# EAGLE schematic Solar-Powered Smart Plant Monitoring IoT Device (EAGLE 9.6.2)
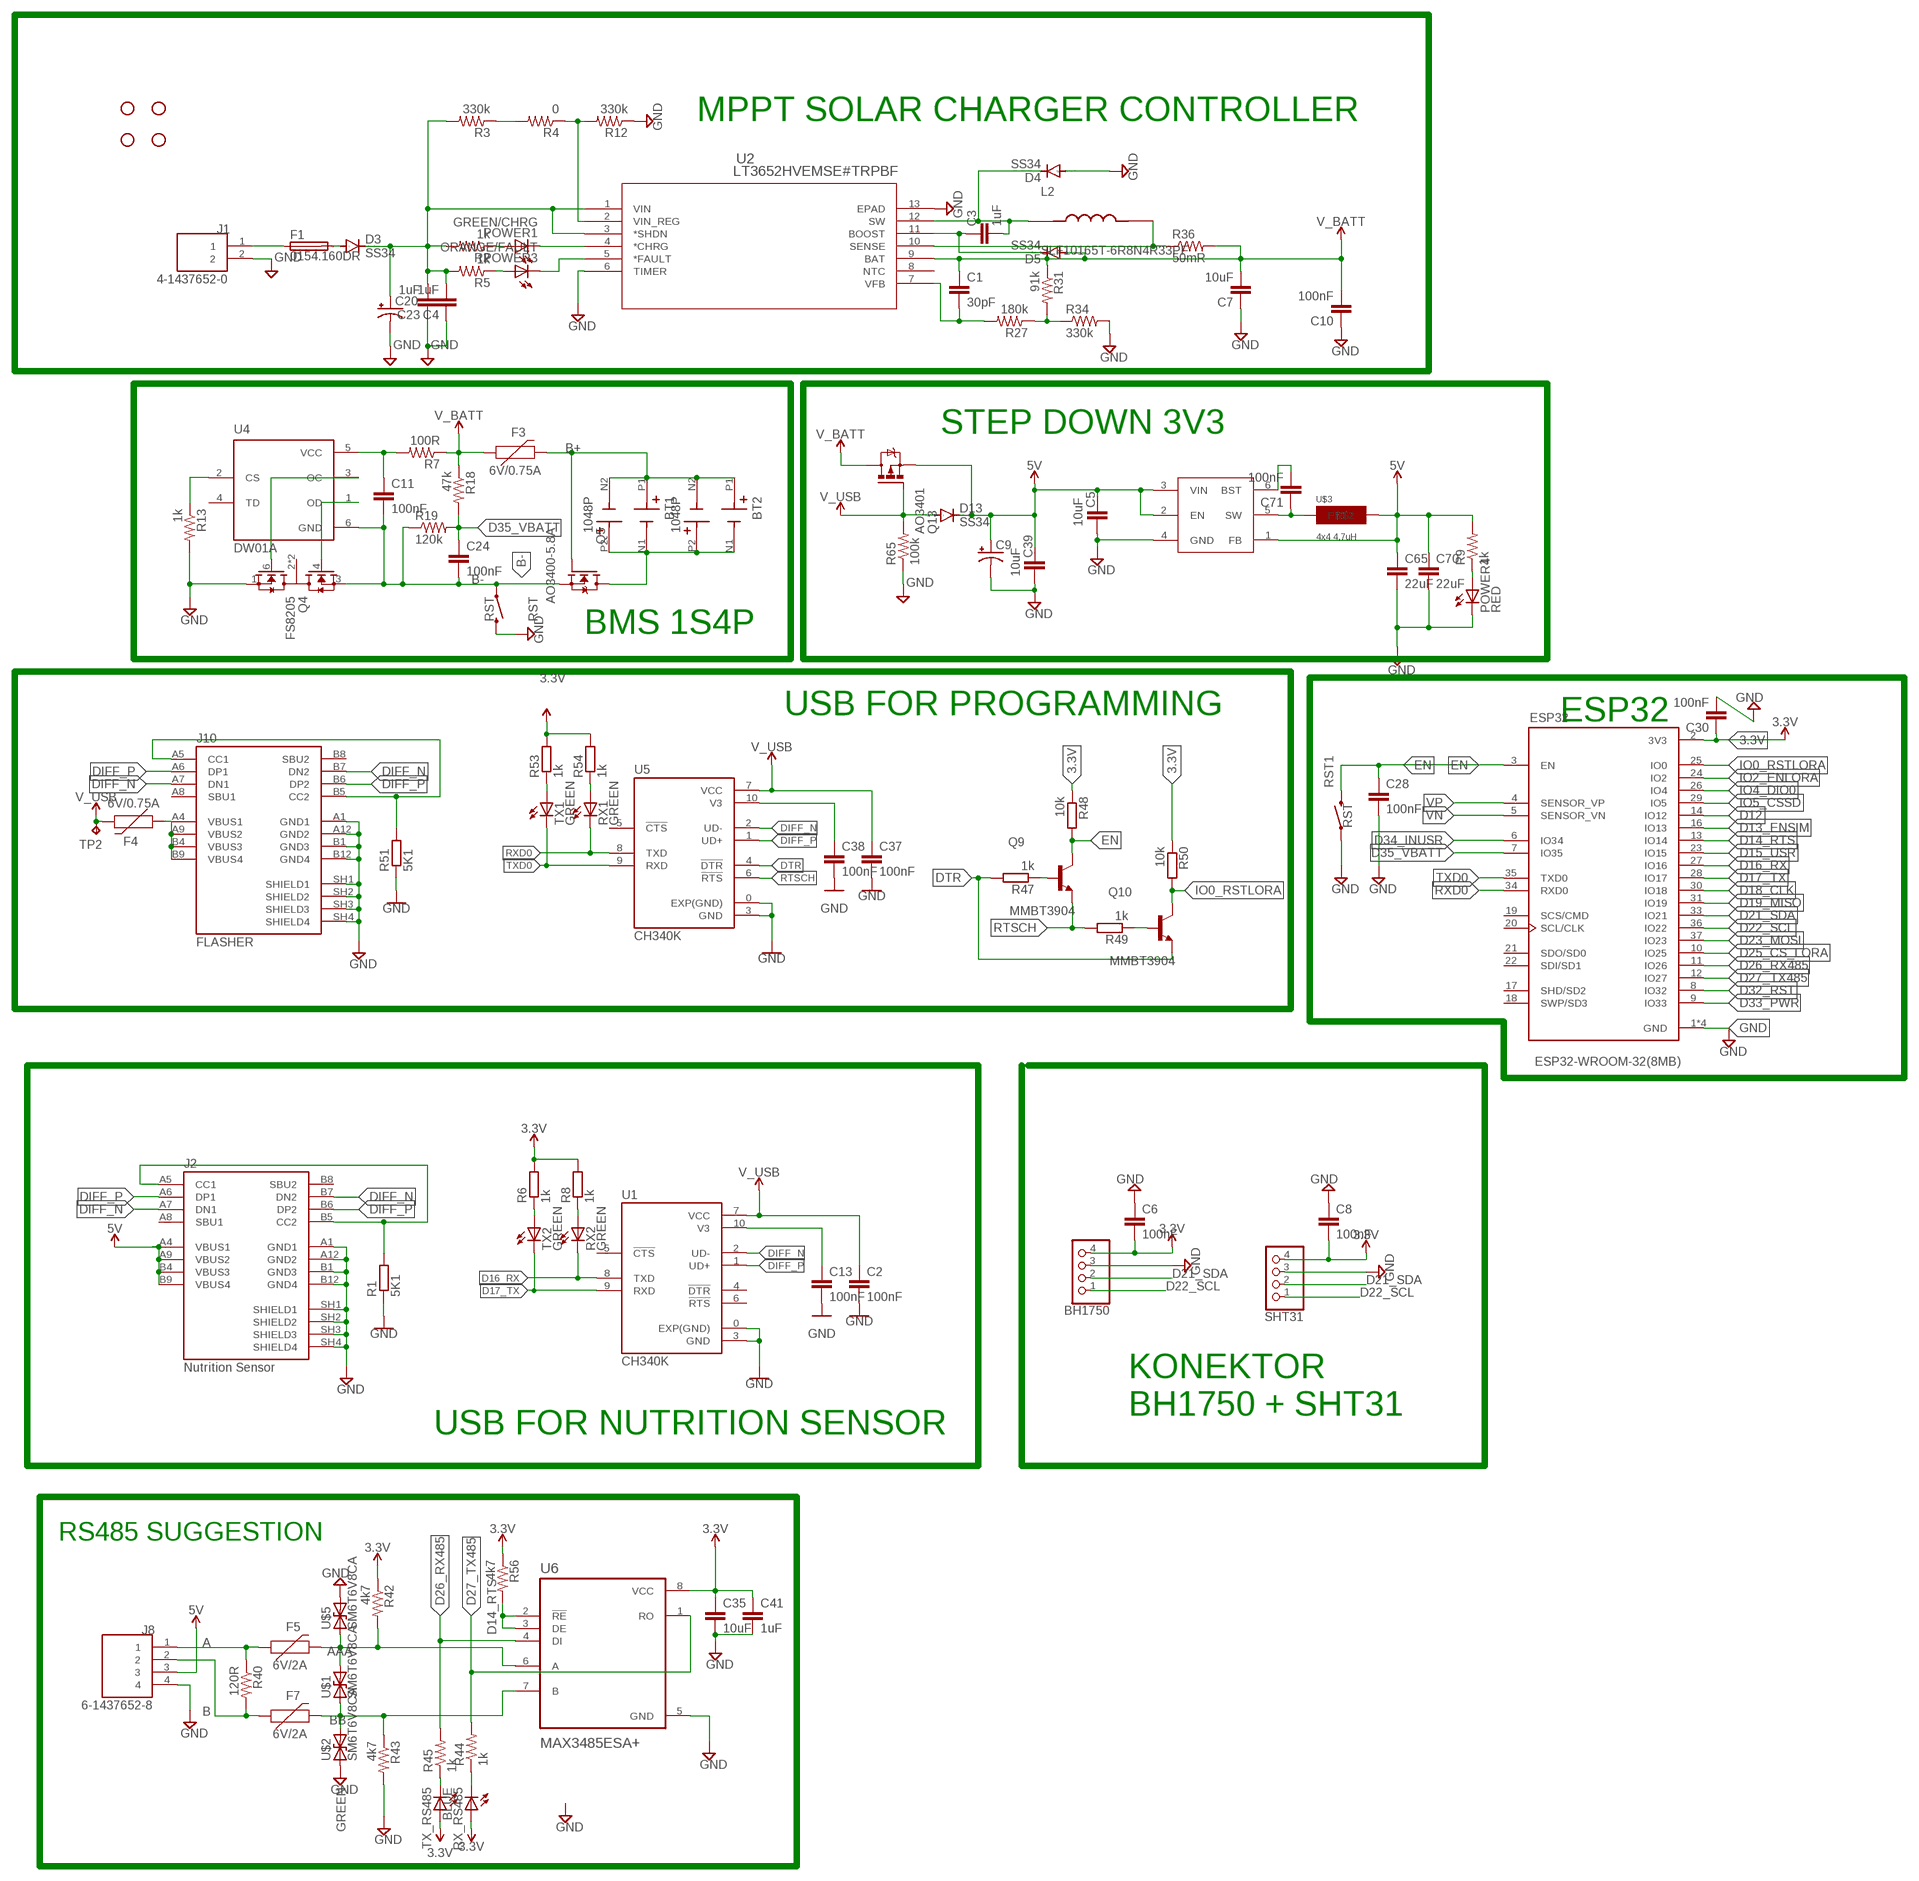
[diagram p0: schematic, sheet 1]

## Parts
BH1750  PINHD-1X4  [1X04]
BT1  1048P  [BAT_1048P]
BT2  1048P  [BAT_1048P]
C1  30pF  C-EUC0603  [C0603]
C2  100nF  C-EUC0603  [C0603]
C3  1uF  C-EUC0603  [C0603]
C4  1uF  C-EUC0805  [C0805]
C5  10uF  C-EUC0805  [C0805]
C6  100nF  C-EUC0603  [C0603]
C7  10uF  C-EUC0805  [C0805]
C8  100nF  C-EUC0603  [C0603]
C9  CPOL-USB/3528-21R  [B/3528-21R]
C10  100nF  C-EUC0603  [C0603]
C11  100nF  C-EUC0603  [C0603]
C13  100nF  C-EUC0603  [C0603]
C20  CPOL-USD/7343-31R  [D/7343-31R]
C23  1uF  C-EUC0805  [C0805]
C24  100nF  C-EUC0603  [C0603]
C28  100nF  C-EUC0603  [C0603]
C30  100nF  C-EUC0603  [C0603]
C35  10uF  C-EUC0603  [C0603]
C37  100nF  C-EUC0603  [C0603]
C38  100nF  C-EUC0603  [C0603]
C39  10uF  C-EUC0603  [C0603]
C41  1uF  C-EUC0603  [C0603]
C65  22uF  C-EUC0805  [C0805]
C70  22uF  C-EUC0805  [C0805]
C71  100nF  C-EUC0805  [C0805]
D3  SS34  DIODE-DO214AC  [DO214AC]
D4  SS34  DIODE-DO214AC  [DO214AC]
D5  SS34  DIODE-DO214AC  [DO214AC]
D13  SS34  DIODE-DO214AC  [DO214AC]
ESP32  ESP32-WROOM-32(8MB)  [MODULE_ESP32-WROOM-32(8MB)]
F1  0154.160DR  [0154007.DR]
F3  6V/0.75A  PPTC_0.75A  [1206]
F4  6V/0.75A  PPTC_0.75A  [1206]
F5  6V/2A  PPTC_6V2A  [1210]
F7  6V/2A  PPTC_6V2A  [1210]
H1  STAND-OFFTIGHT  [STAND-OFF-TIGHT]
H2  STAND-OFFTIGHT  [STAND-OFF-TIGHT]
H3  STAND-OFFTIGHT  [STAND-OFF-TIGHT]
H4  STAND-OFFTIGHT  [STAND-OFF-TIGHT]
J1  4-1437652-0  [TE_4-1437652-0]
J2  Nutrition Sensor  2171820001  [MOLEX_2171820001]
J8  6-1437652-8  [TE_6-1437652-8]
J10  FLASHER  2171820001  [MOLEX_2171820001]
L2  SLF10165T-6R8N4R33PF  [IND_SLF10165T-6R8N4R33PF]
POWER1  GREEN/CHRG  LEDCHIP-LED0603  [CHIP-LED0603]
POWER3  ORANGE/FAULT  LEDCHIP-LED0603  [CHIP-LED0603]
POWER4  RED  LEDCHIP-LED0603  [CHIP-LED0603]
Q4  FS8205  [SOT95P280X145-6N]
Q5  AO3400-5.8A  [SOT95P260X140-3N]
Q9  MMBT3904  [SOT23]
Q10  MMBT3904  [SOT23]
Q13  AO3401  PMOSFET_SOT23  [SOT23]
R1  5K1  R-EU_R0603  [R0603]
R2  1k  R-US_R0603  [R0603]
R3  330k  R-US_R0603  [R0603]
R4  0  R-US_R0603  [R0603]
R5  1k  R-US_R0603  [R0603]
R6  1k  R-EU_R0603  [R0603]
R7  100R  R-US_R0603  [R0603]
R8  1k  R-EU_R0603  [R0603]
R9  1k  R-US_R0603  [R0603]
R12  330k  R-US_R0603  [R0603]
R13  1k  R-US_R0603  [R0603]
R18  47k  R-US_R0603  [R0603]
R19  120k  R-US_R0603  [R0603]
R27  180k  R-US_R0603  [R0603]
R31  91k  R-US_R0603  [R0603]
R34  330k  R-US_R0603  [R0603]
R36  50mR  R-US_R2512  [R2512]
R40  120R  R-US_R0603  [R0603]
R42  4k7  R-US_R0603  [R0603]
R43  4k7  R-US_R0603  [R0603]
R44  1k  R-US_R0603  [R0603]
R45  1k  R-US_R0603  [R0603]
R47  1k  R-EU_R0603  [R0603]
R48  10k  R-EU_R0603  [R0603]
R49  1k  R-EU_R0603  [R0603]
R50  10k  R-EU_R0603  [R0603]
R51  5K1  R-EU_R0603  [R0603]
R53  1k  R-EU_R0603  [R0603]
R54  1k  R-EU_R0603  [R0603]
R56  4k7  R-US_R0603  [R0603]
R65  100k  R-US_R0603  [R0603]
RST  RST  MOMENTARY-SWITCH-SPST-SMD-6.0X3.5MM  [TACTILE_SWITCH_SMD_6.0X3.5MM]
RST1  RST  MOMENTARY-SWITCH-SPST-SMD-6.0X3.5MM  [TACTILE_SWITCH_SMD_6.0X3.5MM]
RX1  GREEN  LEDCHIPLED_0603  [CHIPLED_0603]
RX2  GREEN  LEDCHIPLED_0603  [CHIPLED_0603]
RX_RS485  BLUE  LEDCHIP-LED0603  [CHIP-LED0603]
SHT31  PINHD-1X4  [1X04]
TP2  TPB1,27  [B1,27]
TX1  GREEN  LEDCHIPLED_0603  [CHIPLED_0603]
TX2  GREEN  LEDCHIPLED_0603  [CHIPLED_0603]
TX_RS485  GREEN  LEDCHIP-LED0603  [CHIP-LED0603]
U1  CH340K  [SOP100P600X160-11N]
U2  LT3652HVEMSE#TRPBF  [MSOP-12_MSE]
U4  DW01A  [SOT95P280X145-6N]
U5  CH340K  [SOP100P600X160-11N]
U6  MAX3485ESA+  [SOIC127P600X175-8N]
U$1  SM6T6V8CA  [SMBJ]
U$2  SM6T6V8CA  [SMBJ]
U$3  4x4 4,7uH  SWPA4018S330MT  [SMD_4X4X1.8MM]
U$4  AP63203WU-7  [SOT95P280X100-6N]
U$5  SM6T6V8CA  [SMBJ]

## Nets
3.3V: BH1750.4 C6.2 C8.2 C30.1 C35.1 C41.1 ESP32.2(3V3) R6.2 R8.2 R42.1 R48.1 R50.1 R53.2 R54.2 R56.1 RX_RS485.A SHT31.4 TX_RS485.A U6.8(VCC)
5V: C5.1 C9.+ C39.1 C65.1 C70.1 D13.C J2.A4(VBUS1) J2.A9(VBUS2) J2.B4(VBUS3) J2.B9(VBUS4) J8.3 Q13.2(S) R9.2 U$3.P$2 U$4.1(FB) U$4.2(EN) U$4.3(VIN)
A: F5.1 J8.1 R40.1
AAA: F5.2 R42.2 U6.6(A) U$1.C U$5.A
B: F7.1 J8.2 R40.2
B+: BT1.N2 BT1.P1 BT2.N2 BT2.P1 F3.2 Q5.1(G)
B-: C11.2 C24.2 Q4.3(S2) Q5.2(S) R19.1 RST.1 U4.6(GND)
BB: F7.2 R43.1 U6.7(B) U$1.A U$2.C
D12: ESP32.14(IO12)
D13_ENSIM: ESP32.16(IO13)
D14_RTS: ESP32.13(IO14) R56.2 U6.2(!RE) U6.3(DE)
D15_USR: ESP32.23(IO15)
D16_RX: ESP32.27(IO16) RX2.C U1.8(TXD)
D17_TX: ESP32.28(IO17) TX2.C U1.9(RXD)
D18_CLK: ESP32.30(IO18)
D19_MISO: ESP32.31(IO19)
D21_SDA: BH1750.2 ESP32.33(IO21) SHT31.2
D22_SCL: BH1750.1 ESP32.36(IO22) SHT31.1
D23_MOSI: ESP32.37(IO23)
D25_CS_LORA: ESP32.10(IO25)
D26_RX485: ESP32.11(IO26) R45.2 U6.4(DI)
D27_TX485: ESP32.12(IO27) R44.2 U6.1(RO)
D32_RST: ESP32.8(IO32)
D33_PWR: ESP32.9(IO33)
D34_INUSR: ESP32.6(IO34)
D35_VBATT: C24.1 ESP32.7(IO35) R18.2 R19.2
DIFF_N [diff pairs]: J2.A7(DN1) J2.B7(DN2) J10.A7(DN1) J10.B7(DN2) U1.2(UD-) U5.2(UD-)
DIFF_P [diff pairs]: J2.A6(DP1) J2.B6(DP2) J10.A6(DP1) J10.B6(DP2) U1.1(UD+) U5.1(UD+)
DTR: Q10.2(E) R47.2 U5.4(!DTR)
EN: C28.1 ESP32.3(EN) Q9.3(C) R48.2 RST1.2
GND: BH1750.3 C2.2 C4.1 C5.2 C6.1 C7.1 C8.1 C9.- C10.1 C13.2 C20.- C23.1 C28.2 C30.2 C35.2 C37.2 C38.2 C39.2 C41.2 C65.2 C70.2 D4.A ESP32.1(GND) ESP32.15(GND) ESP32.38(GND) ESP32.39(GND) J1.2 J2.A1(GND1) J2.A12(GND2) J2.B1(GND3) J2.B12(GND4) J2.SH1(SHIELD1) J2.SH2(SHIELD2) J2.SH3(SHIELD3) J2.SH4(SHIELD4) J8.4 J10.A1(GND1) J10.A12(GND2) J10.B1(GND3) J10.B12(GND4) J10.SH1(SHIELD1) J10.SH2(SHIELD2) J10.SH3(SHIELD3) J10.SH4(SHIELD4) POWER4.C Q4.1(S1) R1.1 R12.1 R13.2 R34.2 R43.2 R51.1 R65.1 RST1.1 RST.2 SHT31.3 U1.0(EXP(GND)) U1.3(GND) U2.6(TIMER) U2.13(EPAD) U5.0(EXP(GND)) U5.3(GND) U6.5(GND) U$2.A U$4.4(GND) U$5.C
IO0_RSTLORA: ESP32.25(IO0) Q10.3(C) R50.2
IO2_ENLORA: ESP32.24(IO2)
IO4_DIO0: ESP32.26(IO4)
IO5_CSSD: ESP32.29(IO5)
N$1: BT1.N1 BT1.P2 BT2.N1 BT2.P2 Q5.3(D)
N$2: POWER1.A R2.1
N$3: POWER1.C U2.4(*CHRG)
N$7: F1.1 J1.1
N$8: POWER3.C U2.5(*FAULT)
N$9: D3.A F1.2
N$10: C3.2 D4.C L2.1 U2.12(SW)
N$11: POWER3.A R5.1
N$12: C3.1 D5.C U2.11(BOOST)
N$13: R3.1 R4.2
N$15: C11.1 R7.2 U4.5(VCC)
N$16: J2.A5(CC1) J2.B5(CC2) R1.2
N$17: R4.1 R12.2 U2.2(VIN_REG)
N$19: R6.1 TX2.A
N$20: R8.1 RX2.A
N$21: C13.1 U1.10(V3)
N$22: R13.1 U4.2(CS)
N$24: Q4.6(G1) U4.3(OC)
N$25: Q4.4(G2) U4.1(OD)
N$30: R27.1 R31.2 R34.1
N$33: POWER4.A R9.1
N$34: L2.2 R36.1 U2.10(SENSE)
N$35: C71.1 U$3.P$1 U$4.5(SW)
N$36: C71.2 U$4.6(BST)
N$38: C4.2 C20.+ C23.2 D3.C R2.2 R3.2 R5.2 U2.1(VIN) U2.3(*SHDN)
N$40: C1.2 R27.2 U2.7(VFB)
N$46: R44.1 RX_RS485.C
N$47: R45.1 TX_RS485.C
N$49: Q9.1(B) R47.1
N$50: Q10.1(B) R49.1
N$52: R53.1 TX1.A
N$53: R54.1 RX1.A
N$54: C38.1 U5.10(V3)
N$57: F4.1 J10.A4(VBUS1) J10.A9(VBUS2) J10.B4(VBUS3) J10.B9(VBUS4)
N$58: J10.A5(CC1) J10.B5(CC2) R51.2
RTSCH: Q9.2(E) R49.2 U5.6(!RTS)
RXD0: ESP32.34(RXD0) RX1.C U5.8(TXD)
TXD0: ESP32.35(TXD0) TX1.C U5.9(RXD)
V_BATT: C1.1 C7.2 C10.2 D5.A F3.1 Q13.3(D) R7.1 R18.1 R31.1 R36.2 U2.9(BAT)
V_USB: C2.1 C37.1 D13.A F4.2 Q13.1(G) R65.2 TP2.TP U1.7(VCC) U5.7(VCC)
VN: ESP32.5(SENSOR_VN)
VP: ESP32.4(SENSOR_VP)
Unconnected: ESP32.17(SHD/SD2) ESP32.18(SWP/SD3) ESP32.19(SCS/CMD) ESP32.20(SCL/CLK) ESP32.21(SDO/SD0) ESP32.22(SDI/SD1) J2.A8(SBU1) J2.B8(SBU2) J10.A8(SBU1) J10.B8(SBU2) Q4.2(D12) Q4.5(D12) U1.4(!DTR) U1.5(!CTS) U1.6(!RTS) U2.8(NTC) U4.4(TD) U5.5(!CTS)

## Notes on the sheet
- MPPT SOLAR CHARGER CONTROLLER
- STEP DOWN 3V3
- BMS 1S4P
- USB FOR PROGRAMMING | ESP32
- KONEKTOR 
  BH1750 + SHT31
- USB FOR NUTRITION SENSOR
- RS485 SUGGESTION

## Library data of the parts
BH1750 SHT31 = pinhead:PINHD-1X4: PIN HEADER
BT1 BT2 = 1048P:1048P: Check availability <https://pricing.snapeda.com/parts/1048P/Keystone%20Electronics/view-part?ref=eda>; AVAILABILITY: In Stock; CHECK_PRICES: https://www.snapeda.com/parts/1048P/Keystone/view-part/?ref=eda; DESCRIPTION: SMT Polarized Battery Holder for Dual 18650 Batteries | Keystone Electronics 1048P; MF: Keystone Electronics; MP: 1048P; PACKAGE: None; PRICE: None; SNAPEDA_LINK: https://www.snapeda.com/parts/1048P/Keystone/view-part/?ref=snap
C1-C8 C10 C11 C13 C23 C24 C28 C30 C35 C37-C39 C41 C65 C70 C71 = rcl:C-EU: CAPACITOR, European symbol; SPICEPREFIX: C
C9 C20 = adafruit:CPOL-US: POLARIZED CAPACITOR, American symbol
D3-D5 D13 = diode:DIODE-: DIODE
ESP32 = ESP32-WROOM-32_8MB_:ESP32-WROOM-32(8MB): WIFI MODULE 64 MBITS SPI FLASH; AVAILABILITY: Unavailable; DESCRIPTION: Bluetooth, WiFi 802.11b/g/n, Bluetooth v4.2 +EDR, Class 1, 2 and 3 Transceiver Module 2.4GHz ~ 2.5GHz Surface Mount; MF: Espressif Systems; MP: ESP32-WROOM-32 (8MB); PACKAGE: Module Espressif Systems; PRICE: None
F1 = 0154.160DR:0154.160DR: https://www.mouser.co.cr/ProductDetail/Littelfuse/0154160DR/?qs=gu7KAQ731UR1pT%2F7VWoX3A%3D%3D Check availability <https://pricing.snapeda.com/parts/0154.160DR/Littelfuse%20Inc./view-part?ref=eda>; AVAILABILITY: In Stock; CHECK_PRICES: https://www.snapeda.com/parts/0154.160DR/Littelfuse+Inc./view-part/?ref=eda; DESCRIPTION: 160 mA 125 V AC 125 V DC Fuse Board Mount (Cartridge Style Excluded) Requires Holder, Surface Mount 2-SMD, Square End Block with Holder; MF: Littelfuse Inc.; MP: 0154.160DR; PACKAGE: SMD-2 Littelfuse; PRICE: None; PURCHASE-URL: https://www.snapeda.com/api/url_track_click_mouser/?unipart_id=167017&manufacturer=Littelfuse Inc.&part_name=0154.160DR&search_term=fuse holder; SNAPEDA_LINK: https://www.snapeda.com/parts/0154.160DR/Littelfuse+Inc./view-part/?ref=snap
F3 F4 = SparkFun-Fuses:PPTC: Resettable Fuse PPTC Resettable Fuse. Really a sort of resistor with a polymeric positive temperature coefficient whose resistance increases dramatically with an increase in temperature. When heated by the power passing through the resistance rises causing the current to be limited, protecting the circuit. This is achieved by the transition of the polymer from a crystalline to an amorphous state where the conductive carbon separates breaking the conductive pathways found in the cool crystalline structure. When a PPTC cools back down it resumes conducting letting the circuit turn back on. SparkFun Products: SparkFun RedBoard - Programmed with Arduino <https://www.sparkfun.com/products/12757> Pro Micro - 5V/16MHz <https://www.sparkfun.com/products/12640> Arduino Pro 328 - 5V/16MHz <https://www.sparkfun.com/products/10915> MP3 Trigger <https://www.sparkfun.com/products/13720>; PROD_ID: RES-11150
F5 F7 = SparkFun-Fuses:PPTC: Resettable Fuse PPTC Resettable Fuse. Really a sort of resistor with a polymeric positive temperature coefficient whose resistance increases dramatically with an increase in temperature. When heated by the power passing through the resistance rises causing the current to be limited, protecting the circuit. This is achieved by the transition of the polymer from a crystalline to an amorphous state where the conductive carbon separates breaking the conductive pathways found in the cool crystalline structure. When a PPTC cools back down it resumes conducting letting the circuit turn back on. SparkFun Products: SparkFun RedBoard - Programmed with Arduino <https://www.sparkfun.com/products/12757> Pro Micro - 5V/16MHz <https://www.sparkfun.com/products/12640> Arduino Pro 328 - 5V/16MHz <https://www.sparkfun.com/products/10915> MP3 Trigger <https://www.sparkfun.com/products/13720>; PROD_ID: RES-14313
H1-H4 = SparkFun-Hardware:STAND-OFF: Stand Off Drill holes for mechanically mounting via screws, standoffs, etc. Note: Use the keepout ring to avoid running the screw head into surrounding components. Variant Overviews STAND-OFF - Mechanical footprint for a #4 phillips button head screw. STAND-OFF-TIGHT - Mechanical footprint for a #4 phillips button head screw, Example SparkFun Products Screw - Phillips Head (1/4", 4-40, 10 pack) <https://www.sparkfun.com/products/10453> (PRT-10453) Screw - Phillips Head (1/2", 4-40, 10 pack) <https://www.sparkfun.com/products/10452> (PRT-10452) Screw - Phillips Head (3/4", 4-40, 10 pack) <https://www.sparkfun.com/products/10451> (PRT-10451) Screw - Phillips Head (1", 4-40, 10 pack) <https://www.sparkfun.com/products/10450> (PRT-10450)
J1 = 4-1437652-0:4-1437652-0: Check availability <https://pricing.snapeda.com/parts/4-1437652-0/TE%20Connectivity/view-part?ref=eda>; AVAILABILITY: In Stock; CHECK_PRICES: https://www.snapeda.com/parts/4-1437652-0/TE+Connectivity+AMP+Connectors/view-part/?ref=eda; COMMENT: 4-1437652-0; DESCRIPTION: Conn Barrier Strip 2 POS 9.53mm Solder ST Thru-Hole 25A/Contact; EU_ROHS_COMPLIANCE: Compliant; MF: TE Connectivity; MP: 4-1437652-0; PACKAGE: None; PRICE: None; SNAPEDA_LINK: https://www.snapeda.com/parts/4-1437652-0/TE+Connectivity+AMP+Connectors/view-part/?ref=snap
J2 J10 = 2171820001:2171820001: Check availability <https://pricing.snapeda.com/parts/217182-0001/Molex/view-part?ref=eda>; AVAILABILITY: In Stock; CHECK_PRICES: https://www.snapeda.com/parts/217182-0001/Molex/view-part/?ref=eda; DESCRIPTION: USB Type C - Connector, Vertical SMT L6.4 16pos | Molex Incorporated 217182-0001; MF: Molex; MP: 217182-0001; PACKAGE: None; PRICE: None; SNAPEDA_LINK: https://www.snapeda.com/parts/217182-0001/Molex/view-part/?ref=snap
J8 = 6-1437652-8:6-1437652-8: Check availability <https://pricing.snapeda.com/parts/6-1437652-8/TE%20Connectivity/view-part?ref=eda>; AVAILABILITY: In Stock; CHECK_PRICES: https://www.snapeda.com/parts/6-1437652-8/TE+Connectivity/view-part/?ref=eda; COMMENT: 6-1437652-8; DESCRIPTION: Conn Barrier Strip 4 POS 9.53mm Solder ST Thru-Hole 25A/Contact; EU_ROHS_COMPLIANCE: Compliant; MF: TE Connectivity; MP: 6-1437652-8; PACKAGE: None; PRICE: None; SNAPEDA_LINK: https://www.snapeda.com/parts/6-1437652-8/TE+Connectivity/view-part/?ref=snap
L2 = SLF10165T-6R8N4R33PF:SLF10165T-6R8N4R33PF: Check availability <https://pricing.snapeda.com/parts/SLF10165T-6R8N4R33PF/TDK/view-part?ref=eda>; AVAILABILITY: In Stock; CHECK_PRICES: https://www.snapeda.com/parts/SLF10165T-6R8N4R33PF/TDK/view-part/?ref=eda; DESCRIPTION: 6.8 µH Shielded Drum Core, Wirewound Inductor 4.3 A 18.2mOhm Max Nonstandard; MF: TDK; MP: SLF10165T-6R8N4R33PF; PACKAGE: NON STANDARD-2 TDK; PRICE: None; SNAPEDA_LINK: https://www.snapeda.com/parts/SLF10165T-6R8N4R33PF/TDK/view-part/?ref=snap
POWER1 POWER3 POWER4 RX1 RX2 RX_RS485 TX1 TX2 TX_RS485 = adafruit:LED: LED OSRAM: - CHIPLED LG R971, LG N971, LY N971, LG Q971, LY Q971, LO R971, LY R971 LH N974, LH R974 LS Q976, LO Q976, LY Q976 LO Q996 - Hyper CHIPLED LW Q18S LB Q993, LB Q99A, LB R99A - SideLED LS A670, LO A670, LY A670, LG A670, LP A670 LB A673, LV A673, LT A673, LW A673 LH A674 LY A675 LS A676, LA A676, LO A676, LY A676, LW A676 LS A679, LY A679, LG A679 - Hyper Micro SIDELED® LS Y876, LA Y876, LO Y876, LY Y876 LT Y87S - SmartLED LW L88C, LW L88S LB L89C, LB L89S, LG L890 LS L89K, LO L89K, LY L89K LS L896, LA L896, LO L896, LY L896 - TOPLED LS T670, LO T670, LY T670, LG T670, LP T670 LSG T670, LSP T670, LSY T670, LOP T670, LYG T670 LG T671, LOG T671, LSG T671 LB T673, LV T673, LT T673, LW T673 LH T674 LS T676, LA T676, LO T676, LY T676, LB T676, LH T676, LSB T676, LW T676 LB T67C, LV T67C, LT T67C, LS T67K, LO T67K, LY T67K, LW E67C LS E67B, LA E67B, LO E67B, LY E67B, LB E67C, LV E67C, LT E67C LW T67C LS T679, LY T679, LG T679 LS T770, LO T770, LY T770, LG T770, LP T770 LB T773, LV T773, LT T773, LW T773 LH T774 LS E675, LA E675, LY E675, LS T675 LS T776, LA T776, LO T776, LY T776, LB T776 LHGB T686 LT T68C, LB T68C - Hyper Mini TOPLED® LB M676 - Mini TOPLED Santana® LG M470 LS M47K, LO M47K, LY M47K Source: http://www.osram.convergy.de/
Q4 = FS8205:FS8205: Dual N Channel Enhancement Mode Power MOSFET Check availability <https://pricing.snapeda.com/parts/FS8205/Fortune%20Semiconductor/view-part?ref=eda>; AVAILABILITY: In Stock; CHECK_PRICES: https://www.snapeda.com/parts/FS8205/Fortune+Semiconductor/view-part/?ref=eda; DESCRIPTION: Dual N-Channel Enhancement Mode Power MOSFET; MF: Fortune Semiconductor; MP: FS8205; PACKAGE: Package; PRICE: None; SNAPEDA_LINK: https://www.snapeda.com/parts/FS8205/Fortune+Semiconductor/view-part/?ref=snap
Q5 = AO3400-5.8A:AO3400-5.8A; MANUFACTURER: MDD; MAXIMUM_PACKAGE_HEIGHT: 1.4 mm; PARTREV: A2; SNAPEDA_PN: AO3400-5.8A; STANDARD: IPC 7351B
Q9 Q10 = Transistor:MMBT3904: TRANS NPN 40V 0.2A SOT-23 Manufacturer's datasheet <https://www.onsemi.com/pub/Collateral/PZT3904-D.pdf>; CREATED_BY: PCBLayout.com; DIGIKEY_PART_NUMBER: MMBT3904FSCT-ND; MANUFACTURER: ON Semiconductor; MPN: MMBT3904; PACKAGE: SOT-23-3
Q13 = Transistor:PMOSFET: P-Channel MOSFET - Generic; CATEGORY: Transistor; SUB-CATEGORY: MOSFET; TYPE: P-Channel; VALUE: PMOSFET
R1 R6 R8 R47-R51 R53 R54 = rcl:R-EU_: RESISTOR, European symbol; SPICEPREFIX: R
R2-R5 R7 R9 R12 R13 R18 R19 R27 R31 R34 R36 R40 R42-R45 R56 R65 = adafruit:R-US_: RESISTOR, American symbol
RST RST1 = SparkFun-Switches:MOMENTARY-SWITCH-SPST: Momentary Switch (Pushbutton) - SPST Normally-open (NO) SPST momentary switches (buttons, pushbuttons). Variants PTH-12MM - 12mm square, through-hole Momentary Pushbutton Switch - 12mm Square <https://www.sparkfun.com/products/9190> (COM-09190) PTH-6.0MM, PTH-6.0MM-KIT - 6.0mm square, through-hole Mini Pushbutton Switch <https://www.sparkfun.com/products/97> (COM-00097) KIT package intended for soldering kit's - only one side of pads' copper is exposed. PTH-RIGHT-ANGLE-KIT - Right-angle, through-hole Right Angle Tactile Button <https://www.sparkfun.com/products/10791> - Used on SparkFun BigTime Watch Kit <https://www.sparkfun.com/products/11734> SMD-12MM - 12mm square, surface-mount Tactile Button - SMD (12mm) <https://www.sparkfun.com/products/12993> (COM-12993) Used on SparkFun PicoBoard <https://www.sparkfun.com/products/11888> SMD-4.5MM - 4.5mm Square Trackball Switch Used on SparkFun Blackberry Trackballer Breakout <https://www.sparkfun.com/products/13169> SMD-4.6MMX2.8MM - 4.60mm x 2.80mm, surface mount Used on SparkFun Pro Micro - RP2040 <https://www.sparkfun.com/products/17717> SMD-5.2MM, SMD-5.2-REDUNDANT - 5.2mm square, surface-mount Mini Pushbutton Switch - SMD <https://www.sparkfun.com/products/8720> (COM-08720) Used on Arduino Pro Mini <https://www.sparkfun.com/products/11114> REDUNDANT package connects both switch circuits together SMD-6.0X3.5MM - 6.0 x 3.5mm, surface mount Momentary Reset Switch SMD <https://www.sparkfun.com/products/8229> (COM-08229) SMD-6.2MM-TALL - 6.2mm square, surface mount Tactile Button - SMD (6mm) <https://www.sparkfun.com/products/12992> Used on SparkFun Digital Sandbox <https://www.sparkfun.com/products/12651> SMD-RIGHT-ANGLE - Right-angle, surface mount Used on SparkFun Block for Intel® Edison - Arduino <https://www.sparkfun.com/products/13036>; PROD_ID: SWCH-14278; SF_SKU: COM-08229
TP2 = testpad:TP: Test pad
U1 U5 = CH340K:CH340K: Check availability <https://pricing.snapeda.com/parts/CH340K/WCH/view-part?ref=eda>; AVAILABILITY: Not in stock; CHECK_PRICES: https://www.snapeda.com/parts/CH340K/WCH/view-part/?ref=eda; DESCRIPTION: USB to Serial Port Chip; MF: WCH; MP: CH340K; PACKAGE: Package; PRICE: None; SNAPEDA_LINK: https://www.snapeda.com/parts/CH340K/WCH/view-part/?ref=snap
U2 = LT3652HVEMSE_TRPBF:LT3652HVEMSE#TRPBF: Check availability <https://pricing.snapeda.com/parts/LT3652HVEMSE%23TRPBF/Analog%20Devices/view-part?ref=eda>; AVAILABILITY: In Stock; CHECK_PRICES: https://www.snapeda.com/parts/LT3652HVEMSE%23TRPBF/Analog+Devices/view-part/?ref=eda; DESCRIPTION: Power Tracking 2A Battery Charger; MF: Analog Devices; MP: LT3652HVEMSE#TRPBF; PACKAGE: MSOP -12 Analog Devices; PRICE: None; SNAPEDA_LINK: https://www.snapeda.com/parts/LT3652HVEMSE%23TRPBF/Analog+Devices/view-part/?ref=snap
U4 = DW01A:DW01A: Check availability <https://pricing.snapeda.com/parts/DW01A/Fortune%20Semiconductor/view-part?ref=eda>; AVAILABILITY: Not in stock; CHECK_PRICES: https://www.snapeda.com/parts/DW01A/Fortune+Semiconductor/view-part/?ref=eda; DESCRIPTION: One Cell Lithium-ion/Polymer Battery Protection IC; MF: Fortune Semiconductor; MP: DW01A; PACKAGE: SOT-23-6 Fortune Semiconductor; PRICE: None; SNAPEDA_LINK: https://www.snapeda.com/parts/DW01A/Fortune+Semiconductor/view-part/?ref=snap
U6 = MAX3485ESA_:MAX3485ESA+: Check availability <https://pricing.snapeda.com/parts/MAX3485ESA%2B/Analog%20Devices/view-part?ref=eda>; AVAILABILITY: In Stock; CHECK_PRICES: https://www.snapeda.com/parts/MAX3485ESA+/Analog+Devices/view-part/?ref=eda; DESCRIPTION: 3.3V Powered, 10Mbps and Slew-Rate Limited, True RS-485/RS-422 Transceivers; MF: Analog Devices; MP: MAX3485ESA+; PACKAGE: SOIC-8 Maxim; PRICE: None; PURCHASE-URL: https://www.snapeda.com/api/url_track_click_mouser/?unipart_id=225576&manufacturer=Analog Devices&part_name=MAX3485ESA+&search_term=max3485; SNAPEDA_LINK: https://www.snapeda.com/parts/MAX3485ESA+/Analog+Devices/view-part/?ref=snap
U$1 U$2 U$5 = SM6T6V8CA:SM6T6V8CA: Check availability <https://pricing.snapeda.com/parts/SM6T6V8CA/STMicroelectronics/view-part?ref=eda>; AVAILABILITY: In Stock; CHECK_PRICES: https://www.snapeda.com/parts/SM6T6V8CA/STMicroelectronics/view-part/?ref=eda; DESCRIPTION: 13.4V Clamp 298A (8/20µs) Ipp Tvs Diode Surface Mount SMB (DO-214AA); MF: STMicroelectronics; MP: SM6T6V8CA; PACKAGE: DO-214 STMicroelectronics; PRICE: None; SNAPEDA_LINK: https://www.snapeda.com/parts/SM6T6V8CA/STMicroelectronics/view-part/?ref=snap
U$3 = SWPA4018S330MT:SWPA4018S330MT: Check availability <https://pricing.snapeda.com/parts/SWPA4018S330MT/Shenzhen%20Sunlord%20Electronics%20Co.%2C%20Ltd./view-part?ref=eda>; AVAILABILITY: In Stock; CHECK_PRICES: https://www.snapeda.com/parts/SWPA4018S330MT/Sunlord/view-part/?ref=eda; DESCRIPTION: 33 µH Shielded Drum Core, Wirewound Inductor 490 mA 689mOhm Max Nonstandard; MF: Shenzhen Sunlord Electronics Co., Ltd.; MP: SWPA4018S330MT; PACKAGE: None; PRICE: None; SNAPEDA_LINK: https://www.snapeda.com/parts/SWPA4018S330MT/Sunlord/view-part/?ref=snap
U$4 = AP63205WU-7:AP63203WU-7

## Net classes
1 diff pairs: width 0.13 mm